# EAGLE design whack_a_mole (EAGLE 5.11)
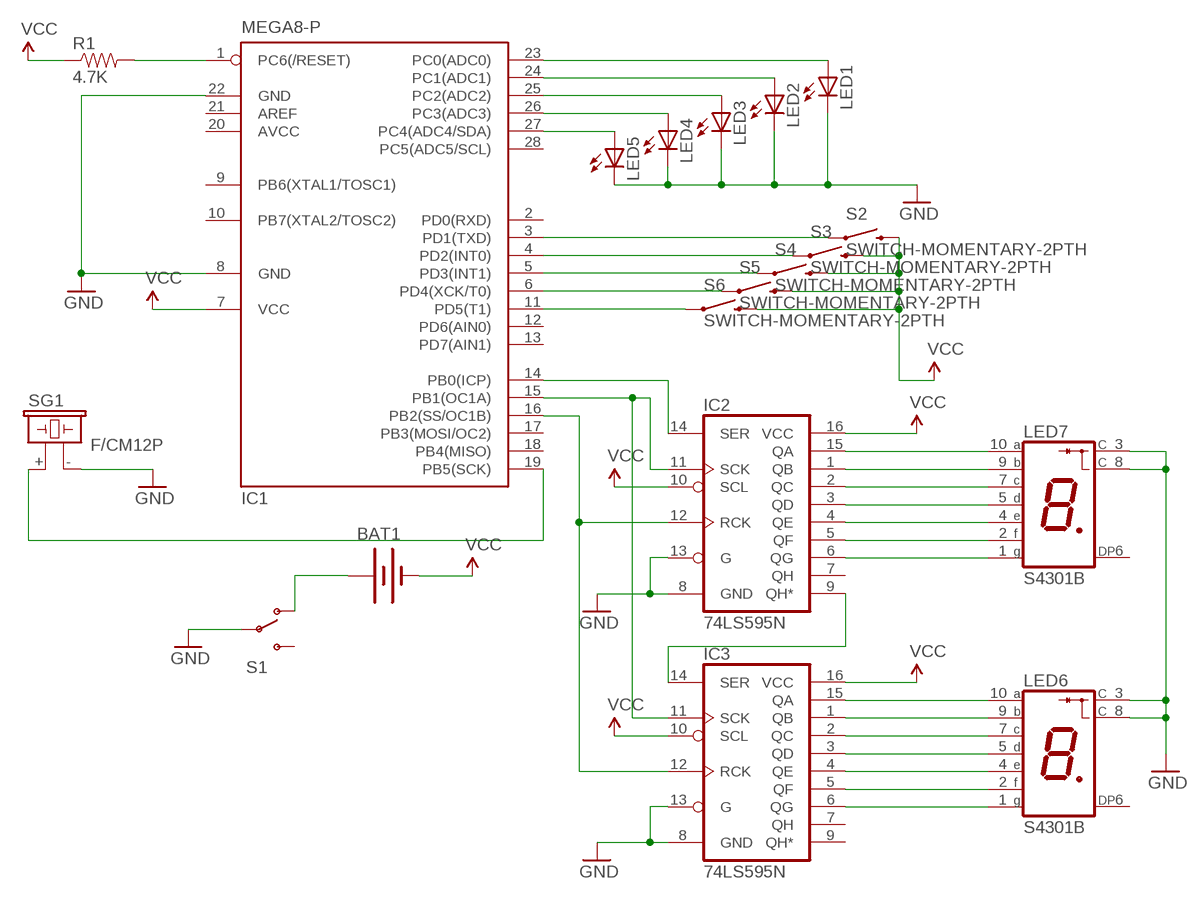
[diagram p0: schematic, sheet 1]

## Parts
BAT1  BATTERY20PTH  [BATTCOM_20MM_PTH]
IC1  MEGA8-P  [DIL28-3]
IC2  74LS595N  [DIL16]
IC3  74LS595N  [DIL16]
LED1  LED5MM  [LED5MM]
LED2  LED5MM  [LED5MM]
LED3  LED5MM  [LED5MM]
LED4  LED5MM  [LED5MM]
LED5  LED5MM  [LED5MM]
LED6  S4301B  [S4301B]
LED7  S4301B  [S4301B]
R1  4.7K  RESISTORPTH1  [AXIAL-0.3]
S1  SWITCH-SPSTPTH  [SWITCH-SPDT]
S2  SWITCH-MOMENTARY-2PTH  [TACTILE-PTH]
S3  SWITCH-MOMENTARY-2PTH  [TACTILE-PTH]
S4  SWITCH-MOMENTARY-2PTH  [TACTILE-PTH]
S5  SWITCH-MOMENTARY-2PTH  [TACTILE-PTH]
S6  SWITCH-MOMENTARY-2PTH  [TACTILE-PTH]
SG1  F/CM12P  [F/CM12P]

## Nets
GND: IC1.8(GND) IC1.22(GND) IC2.8(GND) IC2.13(G) IC3.8(GND) IC3.13(G) LED1.K(C) LED2.K(C) LED3.K(C) LED4.K(C) LED5.K(C) LED6.3(C) LED6.8(C) LED7.3(C) LED7.8(C) S1.2(P) SG1.-
N$1: IC2.15(QA) LED7.10(A)
N$2: IC2.1(QB) LED7.9(B)
N$3: IC2.2(QC) LED7.7(C)
N$4: IC2.3(QD) LED7.5(D)
N$5: IC2.4(QE) LED7.4(E)
N$6: IC2.5(QF) LED7.2(F)
N$7: IC2.6(QG) LED7.1(G)
N$8: IC3.15(QA) LED6.10(A)
N$9: IC3.1(QB) LED6.9(B)
N$10: IC3.2(QC) LED6.7(C)
N$11: IC3.3(QD) LED6.5(D)
N$12: IC3.4(QE) LED6.4(E)
N$13: IC3.5(QF) LED6.2(F)
N$14: IC3.6(QG) LED6.1(G)
N$15: IC1.23(PC0(ADC0)) LED1.A
N$16: IC1.24(PC1(ADC1)) LED2.A
N$17: IC1.25(PC2(ADC2)) LED3.A
N$18: IC1.26(PC3(ADC3)) LED4.A
N$19: IC1.27(PC4(ADC4/SDA)) LED5.A
N$20: IC1.3(PD1(TXD)) S2.1
N$21: IC1.4(PD2(INT0)) S3.1
N$22: IC1.5(PD3(INT1)) S4.1
N$23: IC1.6(PD4(XCK/T0)) S5.1
N$24: IC1.11(PD5(T1)) S6.1
N$25: IC1.1(PC6(/RESET)) R1.P$2
N$26: IC2.9(QH*) IC3.14(SER)
N$27: BAT1.1(+) S1.1(O)
N$28: IC1.14(PB0(ICP)) IC2.14(SER)
N$29: IC1.15(PB1(OC1A)) IC2.11(SCK) IC3.11(SCK)
N$30: IC1.16(PB2(SS/OC1B)) IC2.12(RCK) IC3.12(RCK)
N$31: IC1.19(PB5(SCK)) SG1.+
VCC: BAT1.2(-) IC1.7(VCC) IC2.10(SCL) IC2.16(VCC) IC3.10(SCL) IC3.16(VCC) R1.P$1 S2.3 S3.3 S4.3 S5.3 S6.3
Unconnected: IC1.2(PD0(RXD)) IC1.9(PB6(XTAL1/TOSC1)) IC1.10(PB7(XTAL2/TOSC2)) IC1.12(PD6(AIN0)) IC1.13(PD7(AIN1)) IC1.17(PB3(MOSI/OC2)) IC1.18(PB4(MISO)) IC1.21(AREF) IC1.28(PC5(ADC5/SCL)) IC2.7(QH) IC3.7(QH) IC3.9(QH*) LED6.6(DP) LED7.6(DP) S1.3(S)

## Power pins joined to a net without a drawn wire
AVCC: IC1.20(AVCC)

## Library data of the parts
BAT1 = SparkFun:BATTERY: Battery Holders Various common sizes : AA, AAA, 20mm coin cell and 12mm coin cell.
IC1 = atmel:MEGA8-P: MICROCONTROLLER 8 Kbytes FLASH, 1 kbytes SRAM, 512 bytes EEPROM, USART, 4-channel 10 bit ADC, 2-channel 8 bit ADC Pin compatible with Atmega48, ATMega88, ATMega168 Source: avr.lbr; OC_FARNELL: unknown; OC_NEWARK: unknown
IC2 IC3 = SparkFun:74*595: 8-bit SHIFT REGISTER, output latch
LED1-LED5 = led:LED: LED OSRAM: - CHIPLED LG R971, LG N971, LY N971, LG Q971, LY Q971, LO R971, LY R971 LH N974, LH R974 LS Q976, LO Q976, LY Q976 LO Q996 - Hyper CHIPLED LW Q18S LB Q993, LB Q99A, LB R99A - SideLED LS A670, LO A670, LY A670, LG A670, LP A670 LB A673, LV A673, LT A673, LW A673 LH A674 LY A675 LS A676, LA A676, LO A676, LY A676, LW A676 LS A679, LY A679, LG A679 - Hyper Micro SIDELED® LS Y876, LA Y876, LO Y876, LY Y876 LT Y87S - SmartLED LW L88C, LW L88S LB L89C, LB L89S, LG L890 LS L89K, LO L89K, LY L89K LS L896, LA L896, LO L896, LY L896 - TOPLED LS T670, LO T670, LY T670, LG T670, LP T670 LSG T670, LSP T670, LSY T670, LOP T670, LYG T670 LG T671, LOG T671, LSG T671 LB T673, LV T673, LT T673, LW T673 LH T674 LS T676, LA T676, LO T676, LY T676, LB T676, LH T676, LSB T676, LW T676 LB T67C, LV T67C, LT T67C, LS T67K, LO T67K, LY T67K, LW E67C LS E67B, LA E67B, LO E67B, LY E67B, LB E67C, LV E67C, LT E67C LW T67C LS T679, LY T679, LG T679 LS T770, LO T770, LY T770, LG T770, LP T770 LB T773, LV T773, LT T773, LW T773 LH T774 LS E675, LA E675, LY E675, LS T675 LS T776, LA T776, LO T776, LY T776, LB T776 LHGB T686 LT T68C, LB T68C - Hyper Mini TOPLED® LB M676 - Mini TOPLED Santana® LG M470 LS M47K, LO M47K, LY M47K Source: http://www.osram.convergy.de LUXEON: - LUMILED® LXK2-PW12-R00, LXK2-PW12-S00, LXK2-PW14-U00, LXK2-PW14-V00 LXK2-PM12-R00, LXK2-PM12-S00, LXK2-PM14-U00 LXK2-PE12-Q00, LXK2-PE12-R00, LXK2-PE12-S00, LXK2-PE14-T00, LXK2-PE14-U00 LXK2-PB12-K00, LXK2-PB12-L00, LXK2-PB12-M00, LXK2-PB14-N00, LXK2-PB14-P00, LXK2-PB14-Q00 LXK2-PR12-L00, LXK2-PR12-M00, LXK2-PR14-Q00, LXK2-PR14-R00 LXK2-PD12-Q00, LXK2-PD12-R00, LXK2-PD12-S00 LXK2-PH12-R00, LXK2-PH12-S00 LXK2-PL12-P00, LXK2-PL12-Q00, LXK2-PL12-R00 Source: www.luxeon.com KINGBRIGHT: KA-3528ASYC Source: www.kingbright.com
LED6 LED7 = led-7-segment:S4301B: Single Digit Seven-Segment Display (cathode common) Source: LITEON .. S4301B.pdf; OC_FARNELL: unknown; OC_NEWARK: unknown
R1 = SparkFun:RESISTOR: Resistor Basic schematic elements and footprints for 0603, 1206, and PTH 1/10th watt (small) resistors.
S1 = SparkFun:SWITCH-SPST: SPST Switch Simple slide switch. Spark Fun Electronics SKU : COM-00102
S2-S6 = SparkFun:SWITCH-MOMENTARY-2
SG1 = buzzer:F/CM12P: BUZZER Source: Buerklin; OC_FARNELL: unknown; OC_NEWARK: unknown

## Board
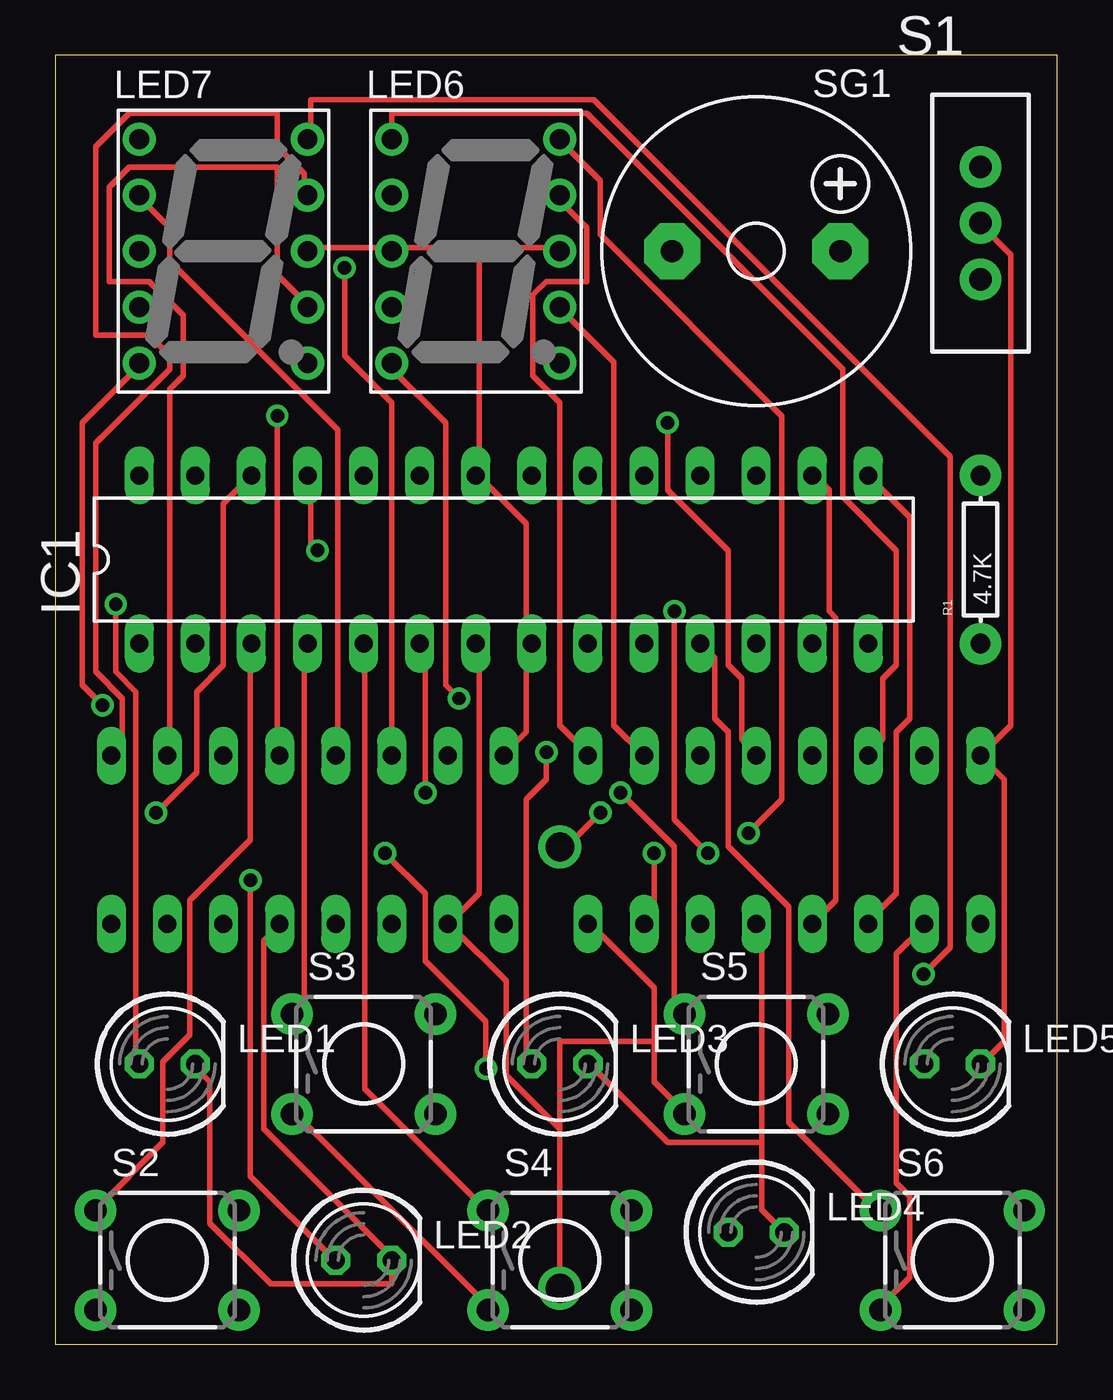
[diagram p1: board, top side]
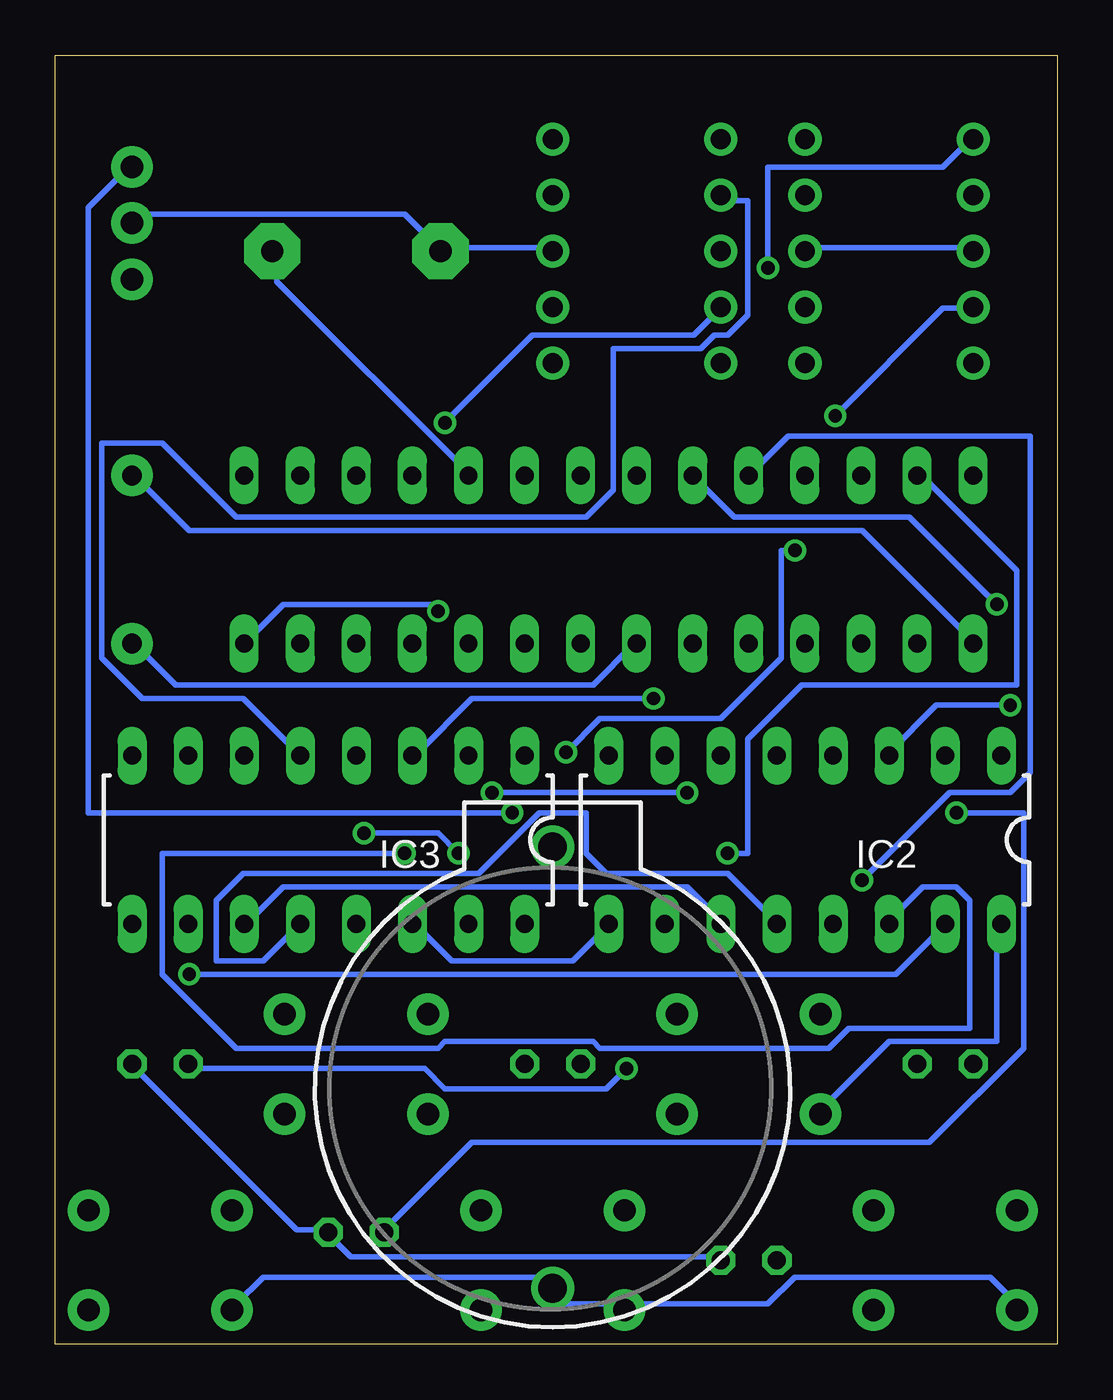
[diagram p2: board, bottom side, seen from below]

Size 45.39 x 58.41 mm. Coordinates in mm from the lower left corner, seen from the top.
Outline: 0,0 45.39,0 45.39,58.41 0,58.41 0,0
Copper layers (1*16): Top 0.035mm / dielectric 1.5mm / Bottom 0.035mm
Design rules "default": minimum track width 10mil, minimum drill 24mil, track to track 8mil, track to pad 8mil, pad to pad 8mil, via to via 8mil, smd to smd 8mil, copper to edge 40mil, drill to drill 8mil, minimum pad ring 10mil, minimum via ring 8mil, stop-mask expansion 4mil, vias tented up to drill 0mil, thermal gap 10mil

### Footprints (pad centres in the part's own frame; a part is rotated, then mirrored left to right if it is on the bottom)
BATTCOM_20MM_PTH = drill 1.3 round: 1 20,0; 2 0,0
DIL28-3 = drill 0.813 long: 1 -16.51,-3.81; 2 -13.97,-3.81; 3 -11.43,-3.81; 4 -8.89,-3.81; 5 -6.35,-3.81; 6 -3.81,-3.81; 7 -1.27,-3.81; 8 1.27,-3.81; 9 3.81,-3.81; 10 6.35,-3.81; 11 8.89,-3.81; 12 11.43,-3.81; 13 13.97,-3.81; 14 16.51,-3.81; 15 16.51,3.81; 16 13.97,3.81; 17 11.43,3.81; 18 8.89,3.81; 19 6.35,3.81; 20 3.81,3.81; 21 1.27,3.81; 22 -1.27,3.81; 23 -3.81,3.81; 24 -6.35,3.81; 25 -8.89,3.81; 26 -11.43,3.81; 27 -13.97,3.81; 28 -16.51,3.81
DIL16 = drill 0.813 long: 1 -8.89,-3.81; 2 -6.35,-3.81; 3 -3.81,-3.81; 4 -1.27,-3.81; 5 1.27,-3.81; 6 3.81,-3.81; 7 6.35,-3.81; 8 8.89,-3.81; 9 8.89,3.81; 10 6.35,3.81; 11 3.81,3.81; 12 1.27,3.81; 13 -1.27,3.81; 14 -3.81,3.81; 15 -6.35,3.81; 16 -8.89,3.81
LED5MM = drill 0.813 octagon: A -1.27,0; K 1.27,0
S4301B = drill 0.9 pad 1.5 round: 1 -3.81,5.08; 2 -3.81,2.54; 3 -3.81,0; 4 -3.81,-2.54; 5 -3.81,-5.08; 6 3.81,-5.08; 7 3.81,-2.54; 8 3.81,0; 9 3.81,2.54; 10 3.81,5.08
AXIAL-0.3 = drill 0.9 pad 1.88 round: P$1 -3.81,0; P$2 3.81,0
SWITCH-SPDT = drill 1.016 pad 1.88 round: 1 0,2.54; 2 0,0; 3 0,-2.54
TACTILE-PTH = drill 1.016 pad 1.88 round: 1 -3.251,2.261; 2 3.251,2.261; 3 -3.251,-2.261; 4 3.251,-2.261
F/CM12P = drill 1.016 pad 2.54 octagon: + 3.81,0; - -3.81,0

### Placement (x,y rotation side)
BAT1  22.86,2.54 90 bottom
IC1  20.32,35.56 0 top
IC2  11.43,22.86 180 bottom
IC3  33.02,22.86 180 bottom
LED1  5.08,12.7 0 top
LED2  13.97,3.81 0 top
LED3  22.86,12.7 0 top
LED4  31.75,5.08 0 top
LED5  40.64,12.7 0 top
LED6  19.05,49.53 0 top
LED7  7.62,49.53 0 top
R1  41.91,35.56 90 top
S1  41.91,50.8 0 top
S2  5.08,3.81 0 top
S3  13.97,12.7 0 top
S4  22.86,3.81 0 top
S5  31.75,12.7 0 top
S6  40.64,3.81 0 top
SG1  31.75,49.53 0 top

### Tracks (layer width: path | path; a pad name or v marks a point on that pad's centre or on a via)
GND
  Top 0.254: IC2.13 10.06,18.9 9.45,18.29 9.45,9.75 15.24,3.96 LED2.K 15.24,2.74 9.75,2.74 7.01,5.49 7.01,11.89 6.4,12.5 LED1.K | 32,9.14 32,18.9 IC3.13 | 32,9.14 32,6.1 LED4.K | 32,9.14 27.74,9.14 24.38,12.5 LED3.K | LED5.K 42.06,12.8 42.98,13.72 42.98,25.6 IC3.8 43.28,28.04 43.28,49.38 42.06,50.6 S1.2 | IC2.8 20.42,26.82 21.34,27.74 21.34,31.7 IC1.8 21.34,32 21.34,37.19 19.2,39.32 IC1.22 19.2,39.62 19.2,49.68 | 15.24,49.68 11.58,49.68 LED7.8 | 19.2,49.68 22.86,49.68 LED6.8 | 19.2,49.68 15.24,49.68 | 15.24,49.68 LED6.3
  Bottom 0.254: LED5.K 41.76,12.5 34.44,5.18 33.22,5.18 LED4.K 32.92,4.88 32,3.96 15.24,3.96 LED2.K | LED7.3 3.96,49.68 11.28,49.68 LED7.8 | LED6.8 22.86,49.68 27.74,49.68 SG1.- 28.04,49.68 29.57,51.21 41.45,51.21 41.76,50.9 S1.2
N$1  (via drill 0.61)
  Top 0.254: v39.32,16.76 40.54,17.98 40.54,40.23 24.38,56.39 11.58,56.39 11.58,54.86 LED7.10
  Bottom 0.254: v39.32,16.76 7.32,16.76 5.18,18.9 IC2.15
N$2
  Top 0.254: IC2.1 2.74,26.82 3.05,27.13 3.05,29.26 1.83,30.48 1.83,40.84 5.18,44.2 5.18,44.81 4.27,45.72 1.83,45.72 1.83,54.25 3.35,55.78 10.06,55.78 10.06,54.25 11.28,53.03 11.28,52.12 LED7.9
N$3
  Top 0.254: IC2.2 5.18,26.82 5.18,43.28 5.79,43.89 5.79,46.63 4.27,48.16 2.44,48.16 2.44,52.43 3.35,53.34 10.06,53.34 10.06,48.46 11.28,47.24 LED7.7
N$4  (via drill 0.61)
  Top 0.254: v2.13,28.96 1.22,29.87 1.22,41.76 3.66,44.2 LED7.5
  Bottom 0.254: v2.13,28.96 5.49,28.96 7.62,26.82 IC2.3
N$5  (via drill 0.61)
  Top 0.254: v10.06,42.06 10.06,26.82 IC2.4
  Bottom 0.254: v10.06,42.06 5.18,46.94 3.96,46.94 LED7.4
N$6
  Top 0.254: IC2.5 12.8,26.82 12.8,41.45 5.18,49.07 5.18,50.6 3.96,51.82 LED7.2
N$7  (via drill 0.61)
  Top 0.254: v13.11,48.77 13.11,44.81 15.24,42.67 IC2.6
  Bottom 0.254: v13.11,48.77 13.11,53.34 5.18,53.34 3.96,54.56 LED7.1
N$8  (via drill 0.61)
  Top 0.254: v27.13,22.25 27.13,19.51 IC3.15 | v31.39,23.16 32.92,24.69 32.92,42.06 24.69,50.29 24.69,52.73 22.86,54.56 LED6.10
  Bottom 0.254: v27.13,22.25 28.04,23.16 v31.39,23.16
N$9
  Top 0.254: IC3.1 24.08,26.82 22.86,28.04 22.86,42.67 21.64,43.89 21.64,47.55 22.25,48.16 24.08,48.16 24.08,50.6 22.86,51.82 LED6.9
N$10
  Top 0.254: IC3.2 25.3,28.04 25.3,44.5 22.86,46.94 LED6.7
N$11  (via drill 0.61)
  Top 0.254: v18.29,29.26 17.68,29.87 17.68,41.76 15.24,44.2 LED6.5
  Bottom 0.254: v18.29,29.26 26.52,29.26 28.96,26.82 IC3.3
N$12  (via drill 0.61)
  Top 0.254: v27.74,41.76 27.74,38.71 30.48,35.97 30.48,30.79 31.09,30.18 31.09,27.43 31.7,26.82 IC3.4
  Bottom 0.254: v27.74,41.76 23.77,45.72 16.46,45.72 15.24,46.94 LED6.4
N$13
  Bottom 0.254: IC3.5 36.88,29.26 41.45,29.26 43.28,31.09 43.28,40.84 40.54,40.84 37.19,37.49 21.34,37.49 20.12,38.71 20.12,45.11 16.15,45.11 15.54,45.72 14.94,45.72 14.02,46.63 14.02,51.82 15.24,51.82 LED6.2
N$14
  Top 0.254: IC3.6 36.88,26.82 37.49,27.43 37.49,30.18 38.1,30.79 38.1,35.97 35.66,38.41 35.66,44.2 24.08,55.78 15.24,55.78 LED6.1
N$15  (via drill 0.61)
  Top 0.254: v2.74,33.53 2.74,30.48 3.66,29.57 3.66,12.8 LED1.A
  Bottom 0.254: v2.74,33.53 6.71,37.49 14.63,37.49 IC1.23
N$16  (via drill 0.61)
  Top 0.254: v8.84,21.03 8.84,7.62 12.5,3.96 LED2.A
  Bottom 0.254: v8.84,21.03 4.88,24.99 2.13,24.99 1.22,25.91 1.22,41.15 12.19,41.15 IC1.24
N$17  (via drill 0.61)
  Top 0.254: v22.25,26.82 22.25,25.6 21.34,24.69 21.34,12.8 LED3.A | v11.89,35.97 11.58,36.27 11.58,39.32 IC1.25
  Bottom 0.254: v22.25,26.82 20.73,28.35 15.24,28.35 12.5,31.09 12.5,35.97 v11.89,35.97
N$18  (via drill 0.61)
  Top 0.254: v4.57,24.08 6.4,25.91 6.4,29.57 7.62,30.79 7.62,38.1 IC1.26
  Bottom 0.254: v4.57,24.08 1.52,24.08 1.52,13.41 5.79,9.14 26.52,9.14 30.48,5.18 LED4.A
N$19  (via drill 0.61)
  Top 0.254: v14.94,22.25 16.76,20.42 16.76,17.37 19.51,14.63 v19.51,12.5
  Bottom 0.254: v14.94,22.25 14.02,22.25 14.02,27.43 11.58,29.87 1.83,29.87 1.83,35.05 6.1,39.32 IC1.27 | v19.51,12.5 20.42,11.58 27.74,11.58 28.65,12.5 39.32,12.5 LED5.A
N$20
  Top 0.254: IC1.3 8.84,31.7 8.84,22.86 6.1,20.12 6.1,14.02 4.88,12.8 4.88,9.14 1.83,6.1 S2.1
N$21
  Top 0.254: IC1.4 11.28,31.7 11.28,15.54 10.97,15.24 S3.1
N$22
  Top 0.254: IC1.5 14.02,31.7 14.02,11.58 19.51,6.1 S4.1
N$23  (via drill 0.61)
  Top 0.254: v16.76,24.99 16.76,31.7 IC1.6 | v25.6,24.99 28.04,22.55 28.04,15.54 28.35,15.24 S5.1
  Bottom 0.254: v16.76,24.99 v25.6,24.99
N$24
  Top 0.254: IC1.11 29.87,31.09 29.87,28.35 30.48,27.74 30.48,22.55 33.22,19.81 33.22,10.06 37.19,6.1 S6.1
N$25
  Bottom 0.254: IC1.1 3.96,32 8.84,36.88 39.32,36.88 41.76,39.32 R1.P$2
N$26
  Bottom 0.254: IC2.9 20.42,18.9 21.95,17.37 27.43,17.37 28.96,18.9 IC3.14
N$27  (via drill 0.61)
  Top 0.254: v24.69,24.08 22.86,22.25 BAT1.1
  Bottom 0.254: v24.69,24.08 43.89,24.08 43.89,51.51 42.06,53.34 S1.1
N$28  (via drill 0.61)
  Top 0.254: v29.57,22.25 28.04,23.77 v28.04,33.22
  Bottom 0.254: v29.57,22.25 40.54,22.25 40.54,16.76 37.19,13.41 28.04,13.41 27.74,13.72 21.03,13.72 20.73,13.41 10.36,13.41 9.45,14.33 3.96,14.33 3.96,20.12 4.57,20.73 6.1,20.73 7.62,19.2 IC2.14 | v28.04,33.22 28.35,33.53 35.05,33.53 IC1.14
N$29
  Top 0.254: IC1.15 38.71,37.49 38.71,28.35 38.1,27.74 38.1,20.42 36.88,19.2 IC3.11
  Bottom 0.254: IC2.11 15.24,19.2 16.76,20.73 35.05,20.73 36.58,19.2 IC3.11
N$30
  Top 0.254: IC1.16 34.44,39.32 35.05,38.71 35.05,33.22 35.36,32.92 35.36,20.12 IC3.12
  Bottom 0.254: IC2.12 12.8,19.2 14.94,21.34 20.42,21.34 21.34,22.25 21.34,24.08 23.47,24.08 26.21,21.34 36.88,21.34 38.1,20.12 38.1,17.37 35.97,17.37 IC3.12
N$31
  Bottom 0.254: IC1.19 26.82,39.62 35.36,48.16 35.36,49.38 SG1.+
VCC
  Top 0.254: IC1.7 19.2,31.7 19.2,20.42 17.98,19.2 IC2.10 17.98,18.9 20.42,16.46 20.42,12.19 22.86,9.75 | IC3.10 39.32,18.9 38.1,17.68 38.1,7.32 38.71,6.71 38.71,3.05 37.49,1.83 S6.3 | 27.13,13.72 27.13,11.89 28.35,10.67 S5.3 | 27.13,13.72 27.13,16.15 24.38,18.9 IC3.16 | 27.13,13.72 22.86,13.72 22.86,9.75 | BAT1.2 22.86,9.75 | S3.3 10.97,10.36 19.51,1.83 S4.3
  Bottom 0.254: R1.P$1 41.76,31.7 39.93,29.87 21.03,29.87 19.2,31.7 IC1.7 | IC2.16 2.74,18.9 2.74,13.72 7.62,13.72 10.67,10.67 S3.3 | S2.3 1.83,1.83 3.05,3.05 11.89,3.05 13.11,1.83 19.51,1.83 S4.3 19.81,1.83 22.25,1.83 22.86,2.44 BAT1.2 22.86,2.74 23.16,3.05 35.97,3.05 37.19,1.83 S6.3